# EAGLE schematic Arduino_DUE_V02b (EAGLE 6.4)
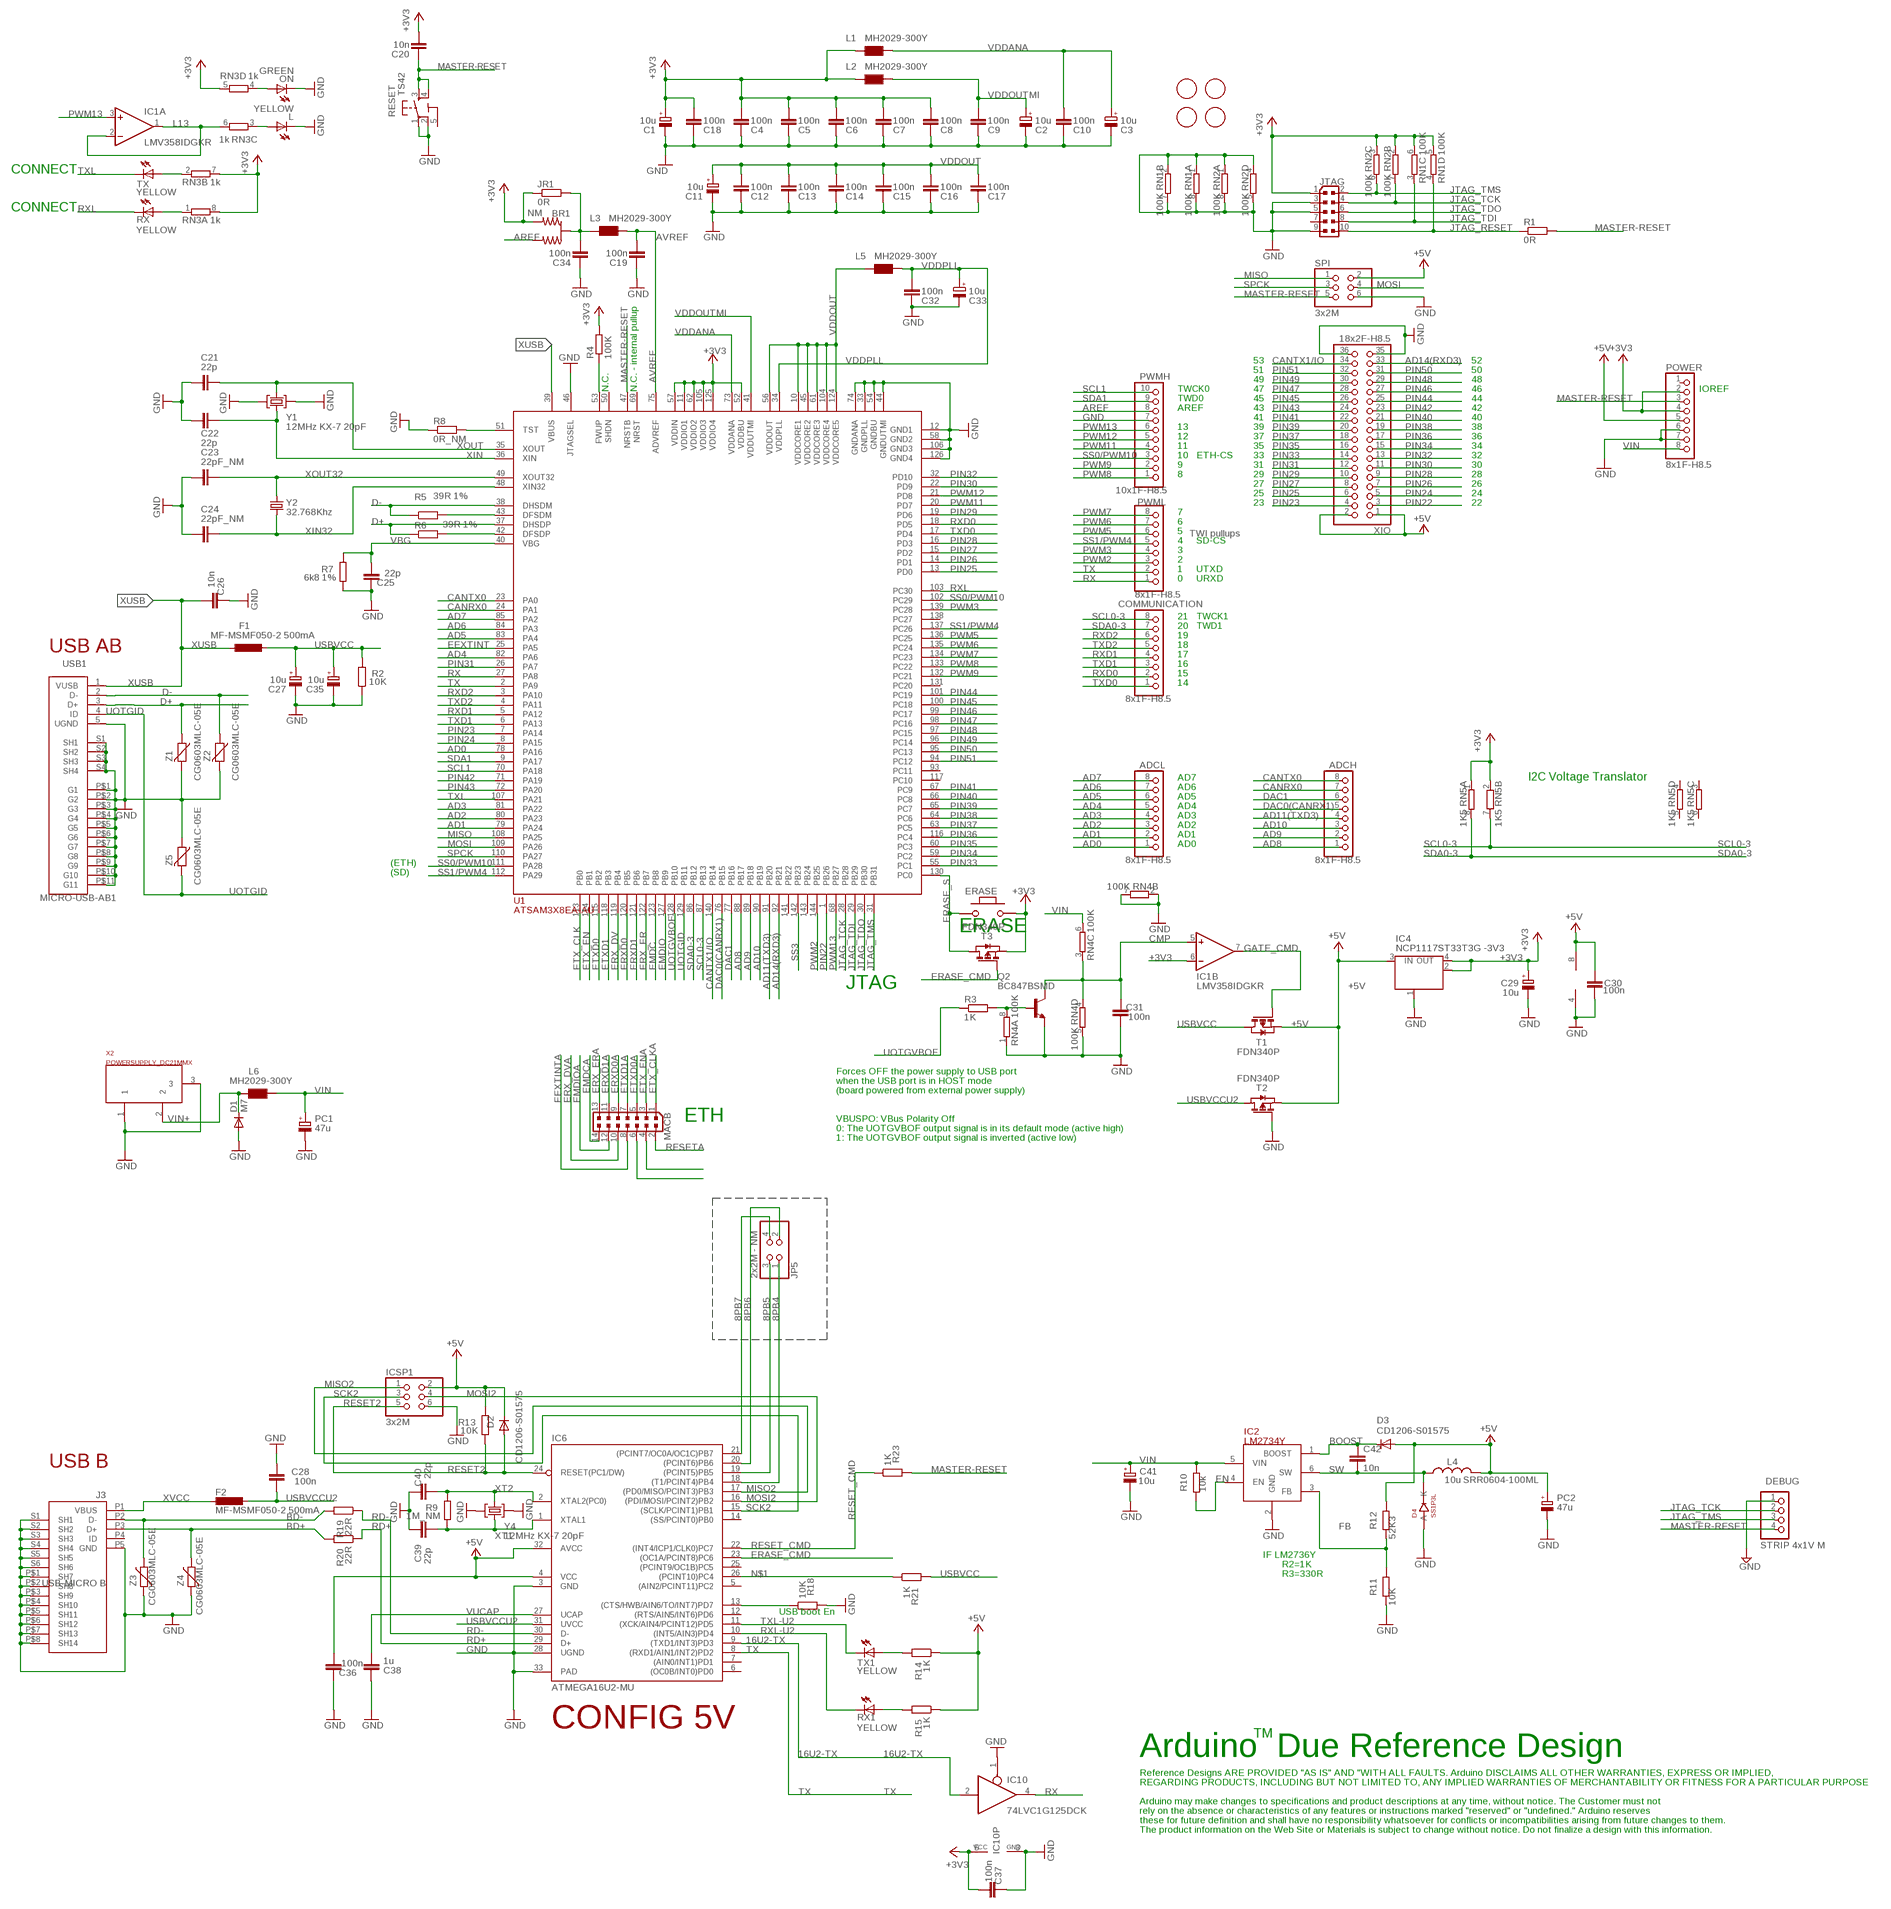
[diagram p0: schematic, sheet 1]

## Parts
ADCH  8x1F-H8.5  PINHD-1X8  [1X08]
ADCL  8x1F-H8.5  PINHD-1X8  [1X08]
BR1  NM  J0402  [J0402]
C1  10u  CPOL-EUSMCB  [SMC_B]
C2  10u  CPOL-EUSMCB  [SMC_B]
C3  10u  CPOL-EUSMCB  [SMC_B]
C4  100n  C-EUC0402  [C0402]
C5  100n  C-EUC0402  [C0402]
C6  100n  C-EUC0402  [C0402]
C7  100n  C-EUC0402  [C0402]
C8  100n  C-EUC0402  [C0402]
C9  100n  C-EUC0402  [C0402]
C10  100n  C-EUC0402  [C0402]
C11  10u  CPOL-EUSMCB  [SMC_B]
C12  100n  C-EUC0402  [C0402]
C13  100n  C-EUC0402  [C0402]
C14  100n  C-EUC0402  [C0402]
C15  100n  C-EUC0402  [C0402]
C16  100n  C-EUC0402  [C0402]
C17  100n  C-EUC0402  [C0402]
C18  100n  C-EUC0402  [C0402]
C19  100n  C-EUC0402  [C0402]
C20  10n  C-EUC0402  [C0402]
C21  22p  C-EUC0402  [C0402]
C22  22p  C-EUC0402  [C0402]
C23  22pF_NM  C-EUC0402  [C0402]
C24  22pF_NM  C-EUC0402  [C0402]
C25  22p  C-EUC0402  [C0402]
C26  10n  C-EUC0402  [C0402]
C27  10u  CPOL-EUSMCB  [SMC_B]
C28  100n  C-EUC0402  [C0402]
C29  10u  CPOL-EUSMCB  [SMC_B]
C30  100n  C-EUC0402  [C0402]
C31  100n  C-EUC0402  [C0402]
C32  100n  C-EUC0402  [C0402]
C33  10u  CPOL-EUSMCB  [SMC_B]
C34  100n  C-EUC0402  [C0402]
C35  10u  CPOL-EUSMCB  [SMC_B]
C36  100n  C-EUC0402  [C0402]
C37  100n  C-EUC0402  [C0402]
C38  1u  C-EUC0402  [C0402]
C39  22p  C-EUC0402  [C0402]
C40  22p  C-EUC0402  [C0402]
C41  10u  CPOL-EUSMCB  [SMC_B]
C42  10n  C-EUC0603  [C0603-ROUND]
COMMUNICATION  8x1F-H8.5  PINHD-1X8  [1X08]
D1  M7  DIODE-SMB  [SMB]
D2  CD1206-S01575  DIODE-MINIMELF  [MINIMELF]
D3  CD1206-S01575  DIODE-MINIMELF  [MINIMELF]
D4  SS1P3L  [DO220AAL]
DEBUG  STRIP 4x1V M  PINHD-1X4  [1X04]
ERASE  MYSMD_PB157  [SMD_157SW]
F1  MF-MSMF050-2 500mA  L-EUL1812  [L1812]
F2  MF-MSMF050-2 500mA  L-EUL1812  [L1812]
FID1  FIDUCIALMOUNT  [FIDUCIA-MOUNT]
FID2  FIDUCIALMOUNT  [FIDUCIA-MOUNT]
FID3  FIDUCIALMOUNT  [FIDUCIA-MOUNT]
FID4  FIDUCIALMOUNT  [FIDUCIA-MOUNT]
IC1  LMV358IDGKR  LMV358MMX  [MSOP08]
IC2  LM2734Y  LM2736Y  [SOT23-6]
IC4  NCP1117ST33T3G -3V3  MC33269ST-3.3T3  [SOT223]
IC6  ATMEGA16U2-MU  [MLF32]
IC10  74LVC1G125DCK  [SC70-5]
ICSP1  3x2M  PINHD-2X3  [2X03]
J3  USB-MICRO B  MYCON2_USB-MINI-B  [CON2_USB_MICRO_B_AT]
JP5  2x2M - NM  PINHD-2X2  [2X02]
JR1  0R  R-EU_R0402  [R0402]
JTAG  PINHEAD_PINHD-2X5PASSO127  [PINHEAD_2X05_127]
L  YELLOW  LEDCHIP-LED0805  [CHIP-LED0805]
L1  MH2029-300Y  WE-CBF_0805  [0805]
L2  MH2029-300Y  WE-CBF_0805  [0805]
L3  MH2029-300Y  WE-CBF_0805  [0805]
L4  10u SRR0604-100ML  L-USSRR0604  [SRR0604]
L5  MH2029-300Y  WE-CBF_0805  [0805]
L6  MH2029-300Y  WE-CBF_0805  [0805]
MACB  PINHEAD_PINHD-2X7PASSO127  [PINHEAD_2X07_127]
ON  GREEN  LEDCHIP-LED0805  [CHIP-LED0805]
PC1  47u  CPOL-EUD  [PANASONIC_D]
PC2  47u  CPOL-EUD  [PANASONIC_D]
POWER  8x1F-H8.5  PINHD-1X8  [1X08]
PWMH  10x1F-H8.5  PINHD-1X10  [1X10]
PWML  8x1F-H8.5  PINHD-1X8  [1X08]
Q2  BC847BSMD  [SOT23]
R1  0R  R-EU_R0402  [R0402]
R2  10K  R-EU_R0402  [R0402]
R3  1K  R-EU_R0402  [R0402]
R4  100K  R-EU_R0402  [R0402]
R5  39R 1%  R-EU_R0402  [R0402]
R6  39R 1%  R-EU_R0402  [R0402]
R7  6k8 1%  R-EU_R0603  [R0603-ROUND]
R8  0R_NM  R-EU_R0402  [R0402]
R9  1M_NM  R-EU_R0402  [R0402]
R10  10k  R-EU_R0402  [R0402]
R11  10K  R-EU_0603-RND  [R0603-ROUND]
R12  52K3  R-EU_0603-RND  [R0603-ROUND]
R13  10K  R-EU_R0402  [R0402]
R14  1K  R-EU_R0402  [R0402]
R15  1K  R-EU_R0402  [R0402]
R18  10K  R-EU_R0402  [R0402]
R19  22R  R-EU_R0402  [R0402]
R20  22R  R-EU_R0402  [R0402]
R21  1K  R-EU_R0402  [R0402]
R23  1K  0140_1K_0402  [R0402]
RESET  TS42  [TS42]
RN1  100K  4R-NCAT16  [CAT16]
RN2  100K  4R-NCAT16  [CAT16]
RN3  1k  4R-NCAY16  [CAY16]
RN4  100K  4R-NCAT16  [CAT16]
RN5  1K5  4R-NCAT16  [CAT16]
RX  YELLOW  LEDCHIP-LED0805  [CHIP-LED0805]
RX1  YELLOW  LEDCHIP-LED0805  [CHIP-LED0805]
SPI  3x2M  PINHD-2X3  [2X03]
T1  FDN340P  PMOSSOT23  [SOT-23]
T2  FDN340P  PMOSSOT23  [SOT-23]
T3  FDN340P  PMOSSOT23  [SOT-23]
TX  YELLOW  LEDCHIP-LED0805  [CHIP-LED0805]
TX1  YELLOW  LEDCHIP-LED0805  [CHIP-LED0805]
U1  ATSAM3X8EA-AU  ATSAM3X/AAU  [LQFP144]
USB1  MICRO-USB-AB1  MICRO_USB  [MCR-AB1-S-RA-SMT]
X2  POWERSUPPLY_DC21MMX  [POWERSUPPLY_DC-21MM]
XIO  18x2F-H8.5  PINHD-2X18  [2X18]
Y1  12MHz KX-7 20pF  CRYSTAL-3.2-2.5  [CRYSTAL-3.2-2.5]
Y2  32.768Khz  RESONATOR_EPSON_FC_145  [RESONATOR_EPSON_FC_145]
Y4  12MHz KX-7 20pF  CRYSTAL-3.2-2.5  [CRYSTAL-3.2-2.5]
Z1  CG0603MLC-05E  VARISTORCN0603  [CT/CN0603]
Z2  CG0603MLC-05E  VARISTORCN0603  [CT/CN0603]
Z3  CG0603MLC-05E  VARISTORCN0603  [CT/CN0603]
Z4  CG0603MLC-05E  VARISTORCN0603  [CT/CN0603]
Z5  CG0603MLC-05E  VARISTORCN0603  [CT/CN0603]

## Nets
8PB4: IC6.18((T1/PCINT4)PB4) JP5.1
8PB5: IC6.19((PCINT5)PB5) JP5.3
8PB6: IC6.20((PCINT6)PB6) JP5.2
8PB7: IC6.21((PCINT7/OC0A/OC1C)PB7) JP5.4
16U2-TX: IC6.9((TXD1/INT3)PD3) IC10.2(I)
+3V3: BR1.3 C1.+ C4.2 C5.2 C6.2 C7.2 C8.2 C18.2 C20.2 C29.+ C37.1 ERASE.1 IC1.6(B:-IN) IC4.2(OUT) IC4.4(OUT) IC10.5(VCC) JR1.1 JTAG.1 L1.1 L2.1 POWER.2 POWER.4 R4.2 RN1.5 RN1.6 RN2.2 RN2.3 RN3.5 RN3.7 RN3.8 RN5.1 RN5.2 T3.2(S) U1.11(VDDIO1) U1.52(VDDBU) U1.57(VDDIN) U1.62(VDDIO2) U1.105(VDDIO3) U1.125(VDDIO4)
+5V: C30.2 C36.1 D2.C D3.A IC1.8(P:V+) IC4.3(IN) IC6.4(VCC) IC6.32(AVCC) ICSP1.2 L4.P$2 PC2.+ POWER.5 R12.1 R13.2 R14.1 R15.1 SPI.2 T1.2(S) T2.2(S) XIO.1 XIO.2
AD0: ADCL.1 U1.78(PA16)
AD1: ADCL.2 U1.79(PA24)
AD2: ADCL.3 U1.80(PA23)
AD3: ADCL.4 U1.81(PA22)
AD4: ADCL.5 U1.82(PA6)
AD5: ADCL.6 U1.83(PA4)
AD6: ADCL.7 U1.84(PA3)
AD7: ADCL.8 U1.85(PA2)
AD8: ADCH.1 U1.88(PB17)
AD9: ADCH.2 U1.89(PB18)
AD10: ADCH.3 U1.90(PB19)
AD11(TXD3): ADCH.4 U1.91(PB20)
AD14(RXD3): U1.92(PB21) XIO.33
AREF: BR1.1 PWMH.8
AVREF: C19.2 L3.2 U1.75(ADVREF)
AVREFL: BR1.2(C) C34.2 JR1.2 L3.1
BD+ [USB]: J3.P3(D+) R20.2 Z4.2
BD- [USB]: J3.P2(D-) R19.2 Z3.2
BOOST: C42.1 D3.C IC2.1(BOOST)
CANRX0: ADCH.7 U1.24(PA1)
CANTX0: ADCH.8 U1.23(PA0)
CANTX1/IO: U1.140(PB14) XIO.34
CMP: C31.2 IC1.5(B:+IN) Q2.3(C) RN4.3 RN4.4
D+ [USB]: R6.1 U1.37(DHSDP) USB1.3(D+) Z1.1
D- [USB]: R5.1 U1.38(DHSDM) USB1.2(D-) Z2.1
DAC0(CANRX1): ADCH.5 U1.76(PB15)
DAC1: ADCH.6 U1.77(PB16)
DTR: IC6.13((CTS/HWB/AIN6/TO/INT7)PD7) R18.1
EEXTINT: U1.25(PA5)
EEXTINTA: MACB.8
EMDC: U1.123(PB8)
EMDCA: MACB.14
EMDIO: U1.127(PB9)
EMDIOA: MACB.12
EN: IC2.4(EN) R10.2
ERASE_CMD: IC6.23((OC1A/PCINT8)PC6) T3.3(G)
ERASE_S: ERASE.2 T3.1(D) U1.130(PC0)
ERX_DV: U1.119(PB4)
ERX_DVA: MACB.10
ERX_ER: U1.122(PB7)
ERX_ERA: MACB.13
ERXD0: U1.120(PB5)
ERXD0A: MACB.9
ERXD1: U1.121(PB6)
ERXD1A: MACB.11
ETX_CLK: U1.113(PB0)
ETX_CLKA: MACB.1
ETX_EN: U1.114(PB1)
ETX_ENA: MACB.3
ETXD0: U1.115(PB2)
ETXD0A: MACB.5
ETXD1: U1.118(PB3)
ETXD1A: MACB.7
FB: IC2.3(FB) R11.1 R12.2
GATE_CMD: IC1.7(B:OUT) T1.3(G)
GND: C1.- C2.- C3.- C4.1 C5.1 C6.1 C7.1 C8.1 C9.1 C10.1 C11.- C12.1 C13.1 C14.1 C15.1 C16.1 C17.1 C18.1 C19.1 C21.2 C22.2 C23.2 C24.2 C25.2 C26.2 C27.- C28.2 C29.- C30.1 C31.1 C32.1 C33.- C34.1 C35.- C36.2 C37.2 C38.2 C39.2 C40.2 C41.- D1.A D4.P$2(A) DEBUG.1 IC1.4(P:V-) IC2.2(GND) IC4.1(GND/ADJ) IC6.3(GND) IC6.28(UGND) IC6.33(PAD) IC10.1(OE) IC10.3(GND) ICSP1.6 J3.P5(GND) J3.P$1(SH7) J3.P$2(SH8) J3.P$3(SH9) J3.P$4(SH10) J3.P$5(SH11) J3.P$6(SH12) J3.P$7(SH13) J3.P$8(SH14) J3.S1(SH1) J3.S2(SH2) J3.S3(SH3) J3.S4(SH4) J3.S5(SH5) J3.S6(SH6) JTAG.3 JTAG.5 JTAG.9 L.C ON.C PC1.- PC2.- POWER.6 POWER.7 PWMH.7 Q2.2(E) R2.1 R7.1 R8.1 R11.2 R18.2 RESET.1 RESET.2 RN1.1 RN1.2 RN1.7 RN1.8 RN2.1 RN2.4 RN2.5 RN2.8 RN4.1 RN4.2 RN4.5 RN4.7 SPI.6 T2.3(G) U1.12(GND1) U1.33(GNDPLL) U1.44(GNDUTMI) U1.46(JTAGSEL) U1.54(GNDBU) U1.58(GND2) U1.74(GNDANA) U1.106(GND3) U1.126(GND4) USB1.5(UGND) USB1.P$1(G1) USB1.P$2(G2) USB1.P$3(G3) USB1.P$4(G4) USB1.P$5(G5) USB1.P$6(G6) USB1.P$7(G7) USB1.P$8(G8) USB1.P$9(G9) USB1.P$10(G10) USB1.P$11(G11) USB1.S1(SH1) USB1.S2(SH2) USB1.S3(SH3) USB1.S4(SH4) X2.1 X2.3 XIO.35 XIO.36 Y1.2(GND) Y1.4(GND) Y4.2(GND) Y4.4(GND) Z1.2 Z2.2 Z3.1 Z4.1 Z5.1
JTAG_RESET: JTAG.10 R1.1 RN1.4
JTAG_TCK: DEBUG.2 JTAG.4 RN2.7 U1.28(PB28)
JTAG_TDI: JTAG.8 RN1.3 U1.29(PB29)
JTAG_TDO: JTAG.6 U1.30(PB30)
JTAG_TMS: DEBUG.3 JTAG.2 RN2.6 U1.31(PB31)
L13: IC1.1(A:OUT) IC1.2(A:-IN) RN3.6
MASTER-RESET: C20.1 DEBUG.4 POWER.3 R1.2 R23.2 RESET.3 RESET.4 SPI.5 U1.47(NRSTB)
MISO: SPI.1 U1.108(PA25)
MISO2: IC6.17((PD0/MISO/PCINT3)PB3) ICSP1.1
MOSI: SPI.4 U1.109(PA26)
MOSI2: IC6.16((PDI/MOSI/PCINT2)PB2) ICSP1.4
N$1: IC6.26((PCINT10)PC4) R21.1
N$2: L.A RN3.3
N$3: ON.A RN3.4
N$4: R15.2 RX1.A
N$5: R8.2 U1.51(TST)
N$6: Q2.1(B) R3.2 RN4.8
N$7: R4.1 U1.53(FWUP)
N$8: MACB.4
N$9: MACB.6
N$11: R5.2 U1.43(DFSDM)
N$12: R6.2 U1.42(DFSDP)
N$14: R14.2 TX1.A
N$54: RN3.1 RX.A
N$55: RN3.2 TX.A
PIN22: U1.1(PB26) XIO.3
PIN23: U1.7(PA14) XIO.4
PIN24: U1.8(PA15) XIO.5
PIN25: U1.13(PD0) XIO.6
PIN26: U1.14(PD1) XIO.7
PIN27: U1.15(PD2) XIO.8
PIN28: U1.16(PD3) XIO.9
PIN29: U1.19(PD6) XIO.10
PIN30: U1.22(PD9) XIO.11
PIN31: U1.26(PA7) XIO.12
PIN32: U1.32(PD10) XIO.13
PIN33: U1.55(PC1) XIO.14
PIN34: U1.59(PC2) XIO.15
PIN35: U1.60(PC3) XIO.16
PIN36: U1.116(PC4) XIO.17
PIN37: U1.63(PC5) XIO.18
PIN38: U1.64(PC6) XIO.19
PIN39: U1.65(PC7) XIO.20
PIN40: U1.66(PC8) XIO.21
PIN41: U1.67(PC9) XIO.22
PIN42: U1.71(PA19) XIO.23
PIN43: U1.72(PA20) XIO.24
PIN44: U1.101(PC19) XIO.25
PIN45: U1.100(PC18) XIO.26
PIN46: U1.99(PC17) XIO.27
PIN47: U1.98(PC16) XIO.28
PIN48: U1.97(PC15) XIO.29
PIN49: U1.96(PC14) XIO.30
PIN50: U1.95(PC13) XIO.31
PIN51: U1.94(PC12) XIO.32
PWM2: PWML.3 U1.144(PB25)
PWM3: PWML.4 U1.139(PC28)
PWM5: PWML.6 U1.136(PC25)
PWM6: PWML.7 U1.135(PC24)
PWM7: PWML.8 U1.134(PC23)
PWM8: PWMH.1 U1.133(PC22)
PWM9: PWMH.2 U1.132(PC21)
PWM11: PWMH.4 U1.20(PD7)
PWM12: PWMH.5 U1.21(PD8)
PWM13: IC1.3(A:+IN) PWMH.6 U1.68(PB27)
RD+: IC6.29(D+) R20.1
RD-: IC6.30(D-) R19.1
RESET2: D2.A IC6.24(RESET(PC1/DW)) ICSP1.5 R13.1
RESET_CMD: IC6.22((INT4/ICP1/CLK0)PC7) R23.1
RESETA: MACB.2
RX: IC10.4(O) PWML.1 U1.27(PA8)
RXD0: COMMUNICATION.2 U1.18(PD5)
RXD1: COMMUNICATION.4 U1.5(PA12)
RXD2: COMMUNICATION.6 U1.3(PA10)
RXL: RX.C U1.103(PC30)
RXL-U2: IC6.10((INT5/AIN3)PD4) RX1.C
SCK2: IC6.15((SCLK/PCINT1)PB1) ICSP1.3
SCL0-3: COMMUNICATION.8 RN5.7 U1.87(PB13)
SCL1: PWMH.10 U1.70(PA18)
SDA0-3: COMMUNICATION.7 RN5.8 U1.86(PB12)
SDA1: PWMH.9 U1.9(PA17)
SPCK: SPI.3 U1.110(PA27)
SS0/PWM10: PWMH.3 U1.102(PC29) U1.111(PA28)
SS1/PWM4: PWML.5 U1.112(PA29) U1.137(PC26)
SS3: U1.142(PB23)
SW: C42.2 D4.P$1(K) IC2.6(SW) L4.P$1
TX: IC6.8((RXD1/AIN1/INT2)PD2) PWML.2 U1.2(PA9)
TXD0: COMMUNICATION.1 U1.17(PD4)
TXD1: COMMUNICATION.3 U1.6(PA13)
TXD2: COMMUNICATION.5 U1.4(PA11)
TXL: TX.C U1.107(PA21)
TXL-U2: IC6.11((XCK/AIN4/PCINT12)PD5) TX1.C
UOTGID: U1.129(PB11) USB1.4(ID) Z5.2
UOTGVBOF: R3.1 U1.128(PB10)
USBVCC: C27.+ C35.+ F1.1 R2.2 R21.2 T1.1(D)
USBVCCU2: C28.1 F2.1 IC6.31(UVCC) T2.1(D)
VBG: C25.1 R7.2 U1.40(VBG)
VDDANA: C3.+ C10.2 L1.2 U1.73(VDDANA)
VDDOUT: C11.+ C12.2 C13.2 C14.2 C15.2 C16.2 C17.2 L5.1 U1.10(VDDCORE1) U1.45(VDDCORE2) U1.56(VDDOUT) U1.61(VDDCORE3) U1.104(VDDCORE4) U1.124(VDDCORE5)
VDDOUTMI: C2.+ C9.2 L2.2 U1.41(VDDUTMI)
VDDPLL: C32.2 C33.+ L5.2 U1.34(VDDPLL)
VIN: C41.+ IC2.5(VIN) L6.1 PC1.+ POWER.8 R10.1 RN4.6
VIN+: D1.C L6.2 X2.2
VUCAP: C38.1 IC6.27(UCAP)
XIN: C22.1 U1.36(XIN) Y1.1(C1)
XIN32: C24.1 U1.48(XIN32) Y2.P$2
XOUT: C21.1 U1.35(XOUT) Y1.3(C2)
XOUT32: C23.1 U1.49(XOUT32) Y2.P$1
XT1: C39.1 IC6.1(XTAL1) R9.1 Y4.1(C1)
XT2: C40.1 IC6.2(XTAL2(PC0)) R9.2 Y4.3(C2)
XUSB [usbvcc]: C26.1 F1.2 U1.39(VBUS) USB1.1(VUSB)
XVCC [usbvcc]: F2.2 J3.P1(VBUS)
Unconnected: IC6.5((AIN2/PCINT11)PC2) IC6.6((OC0B/INT0)PD0) IC6.7((AIN0/INT1)PD1) IC6.12((RTS/AIN5/INT6)PD6) IC6.14((SS/PCINT0)PB0) IC6.25((PCINT9/OC1B)PC5) J3.P4(ID) JTAG.7 POWER.1 RN5.3 RN5.4 RN5.5 RN5.6 U1.50(SHDN) U1.69(NRST) U1.93(PC11) U1.117(PC10) U1.131(PC20) U1.138(PC27) U1.141(PB22) U1.143(PB24)

## Notes on the sheet
- CONNECT
- CONNECT
- 53 | 52
- 51 | 50
- 49 | 48
- N.C. | N.C. - internal pullup | TWCK0 | 47 | 46 | IOREF
- TWD0 | 45 | 44
- AREF | 43 | 42
- 41 | 40
- 13 | 39 | 38
- 12 | 37 | 36
- 11 | 35 | 34
- 10 | ETH-CS | 33 | 32
- 9 | 31 | 30
- 8 | 29 | 28
- 27 | 26
- 25 | 24
- 23 | 22
- 7
- 6
- 5 | TWI pullups
- 4 | SD-CS
- 3
- 2
- 1 | UTXD
- 0 | URXD
- 21 | TWCK1
- 20 | TWD1
- USB AB | 19
- 18
- 17
- 16
- 15
- 14
- AD7 | I2C Voltage Translator
- AD6
- AD5
- AD4
- AD3
- AD2
- AD1
- AD0
- (ETH)
- (SD)
- ERASE
- JTAG
- Forces OFF the power supply to USB port
- when the USB port is in HOST mode
- (board powered from external power supply)
- ETH | VBUSPO: VBus Polarity Off
- 0: The UOTGVBOF output signal is in its default mode (active high)
- 1: The UOTGVBOF output signal is inverted (active low)
- USB B
- IF LM2736Y
- R2=1K
- R3=330R
- USB boot En
- CONFIG 5V
- TM
- Arduino  Due Reference Design
- Reference Designs ARE PROVIDED "AS IS" AND "WITH ALL FAULTS. Arduino DISCLAIMS ALL OTHER WARRANTIES, EXPRESS OR IMPLIED,
- REGARDING PRODUCTS, INCLUDING BUT NOT LIMITED TO, ANY IMPLIED WARRANTIES OF MERCHANTABILITY OR FITNESS FOR A PARTICULAR PURPOSE
- Arduino may make changes to specifications and product descriptions at any time, without notice. The Customer must not
- rely on the absence or characteristics of any features or instructions marked "reserved" or "undefined." Arduino reserves
- these for future definition and shall have no responsibility whatsoever for conflicts or incompatibilities arising from future changes to them.
- The product information on the Web Site or Materials is subject to change without notice. Do not finalize a design with this information.

## Power pins joined to a net without a drawn wire
5-GND: RESET.5(5-GND)

## Library data of the parts
ADCH ADCL COMMUNICATION POWER PWML = SmartPrj:PINHD-1X8: PIN HEADER
BR1 = bibaja:J: Three terminal jumper made from two 0402, 0603, 0805, etc.
C1-C3 C11 C27 C29 C33 C35 C41 PC1 PC2 = rcl:CPOL-EU: POLARIZED CAPACITOR, European symbol
C4-C10 C12-C26 C28 C30-C32 C34 C36-C40 C42 = SmartPrj:C-EU: CAPACITOR, European symbol
D1-D3 = diode:DIODE-: DIODE
D4 = SmartPrj:SS1P3L
DEBUG = pinhead:PINHD-1X4: PIN HEADER
ERASE = SmartPrj:MYSMD_PB157
F1 F2 = rcl:L-EU: INDUCTOR, European symbol
FID1-FID4 = SmartPrj:FIDUCIALMOUNT
IC1 = linear:LMV358?*: Dual General Purpose, Low Voltage, Rail-to-Rail Output Operational Amplifiers Source: http://www.national.com/mpf/LM/LMV321.html http://www.national.com/dt/lmv_qual.pdf
IC2 = SmartPrj:LM2736Y
IC4 = linear:MC33269ST*: Adjustable Output Low Dropout Voltage Regulator 800 mA Source: http://www.onsemi.com/pub/Collateral/MC33269-D.PDF
IC6 = SmartPrj:ATMEGA16U2-
IC10 = 74xx-little-us:74*1G125: Single Bus Buffer Gate with 3-State Output
ICSP1 SPI = SmartPrj:PINHD-2X3: PIN HEADER
J3 = SmartPrj:MYCON2_USB-MINI-B
JP5 = SmartPrj:PINHD-2X2: PIN HEADER
JR1 R1-R15 R18-R21 = SmartPrj:R-EU_: RESISTOR, European symbol
JTAG = Arduino_Wifi_shield_v018_tG:PINHEAD_PINHD-2X5: PIN HEADER
L ON RX RX1 TX TX1 = led:LED: LED OSRAM: - CHIPLED LG R971, LG N971, LY N971, LG Q971, LY Q971, LO R971, LY R971 LH N974, LH R974 LS Q976, LO Q976, LY Q976 LO Q996 - Hyper CHIPLED LW Q18S LB Q993, LB Q99A, LB R99A - SideLED LS A670, LO A670, LY A670, LG A670, LP A670 LB A673, LV A673, LT A673, LW A673 LH A674 LY A675 LS A676, LA A676, LO A676, LY A676, LW A676 LS A679, LY A679, LG A679 - Hyper Micro SIDELED® LS Y876, LA Y876, LO Y876, LY Y876 LT Y87S - SmartLED LW L88C, LW L88S LB L89C, LB L89S, LG L890 LS L89K, LO L89K, LY L89K LS L896, LA L896, LO L896, LY L896 - TOPLED LS T670, LO T670, LY T670, LG T670, LP T670 LSG T670, LSP T670, LSY T670, LOP T670, LYG T670 LG T671, LOG T671, LSG T671 LB T673, LV T673, LT T673, LW T673 LH T674 LS T676, LA T676, LO T676, LY T676, LB T676, LH T676, LSB T676, LW T676 LB T67C, LV T67C, LT T67C, LS T67K, LO T67K, LY T67K, LW E67C LS E67B, LA E67B, LO E67B, LY E67B, LB E67C, LV E67C, LT E67C LW T67C LS T679, LY T679, LG T679 LS T770, LO T770, LY T770, LG T770, LP T770 LB T773, LV T773, LT T773, LW T773 LH T774 LS E675, LA E675, LY E675, LS T675 LS T776, LA T776, LO T776, LY T776, LB T776 LHGB T686 LT T68C, LB T68C - Hyper Mini TOPLED® LB M676 - Mini TOPLED Santana® LG M470 LS M47K, LO M47K, LY M47K Source: http://www.osram.convergy.de LUXEON: - LUMILED® LXK2-PW12-R00, LXK2-PW12-S00, LXK2-PW14-U00, LXK2-PW14-V00 LXK2-PM12-R00, LXK2-PM12-S00, LXK2-PM14-U00 LXK2-PE12-Q00, LXK2-PE12-R00, LXK2-PE12-S00, LXK2-PE14-T00, LXK2-PE14-U00 LXK2-PB12-K00, LXK2-PB12-L00, LXK2-PB12-M00, LXK2-PB14-N00, LXK2-PB14-P00, LXK2-PB14-Q00 LXK2-PR12-L00, LXK2-PR12-M00, LXK2-PR14-Q00, LXK2-PR14-R00 LXK2-PD12-Q00, LXK2-PD12-R00, LXK2-PD12-S00 LXK2-PH12-R00, LXK2-PH12-S00 LXK2-PL12-P00, LXK2-PL12-Q00, LXK2-PL12-R00 Source: www.luxeon.com KINGBRIGHT: KA-3528ASYC Source: www.kingbright.com
L1-L3 L5 L6 = wuerth-elektronik:WE-CBF: SMD EMI Suppression Ferrite Beads - excellent anti-EMI properties - low DCR - impedances till 3000 ohms - rated current up to 6 A
L4 = SmartPrj:L-US: INDUCTOR, American symbol
MACB = Arduino_Wifi_shield_v018_tG:PINHEAD_PINHD-2X7: PIN HEADER
PWMH = SmartPrj:PINHD-1X10: PIN HEADER
Q2 = transistor-npn:BC847*: NPN Transistor
R23 = Resistenze:0140_1K_0402: 1K 0402; CASE: 0402; MONTHLY_USAGE: _____; PART_NUMBER: 1K_0402; PRICE: _____; SUPPLIER: _____; TYPE: Resistenze
RESET = SmartPrj:TS42: TS42 Dongnan Electronics Tact switch VDC 12V - 50mA
RN1-RN5 = resistor-dil:4R-N: Array Chip Resistor Source: RS Component / Phycomp
T1-T3 = zetex:PMOSSOT23: MOS FET
U1 = SmartPrj:ATSAM3X/A
USB1 = SmartPrj:MICRO_USB: Micro_USB ADAM-TECH MCR-AB1-S-RA-SMT
X2 = SmartPrj:POWERSUPPLY_DC21MM
XIO = SmartPrj:PINHD-2X18: PIN HEADER
Y1 Y4 = SmartPrj:CRYSTAL-3.2-2.5
Y2 = Arduino_Wifi_shield_v018_tG:RESONATOR_EPSON_FC_145
Z1-Z5 = varistor:VARISTOR: VARISTOR

## Net classes
0 default: width 0.203 mm, drill 0.305 mm, clearance 0.203 mm
1 USB: drill 0.406 mm, clearance 0.203 mm to class 0, clearance 0.406 mm
2 gnd: width 0.305 mm, drill 0.406 mm, clearance 0.203 mm to class 0, clearance 0.203 mm
3 usbvcc: width 0.61 mm, drill 0.508 mm, clearance 0.203 mm to class 0, clearance 0.254 mm